# Altium schematic sheet AdamDynamic VCA-001.SchDoc
size A4; Organization: Altium Limited; Address1: 3 Minna Close; Address2: Belrose; Address3: NSW 2085; Address4: Australia
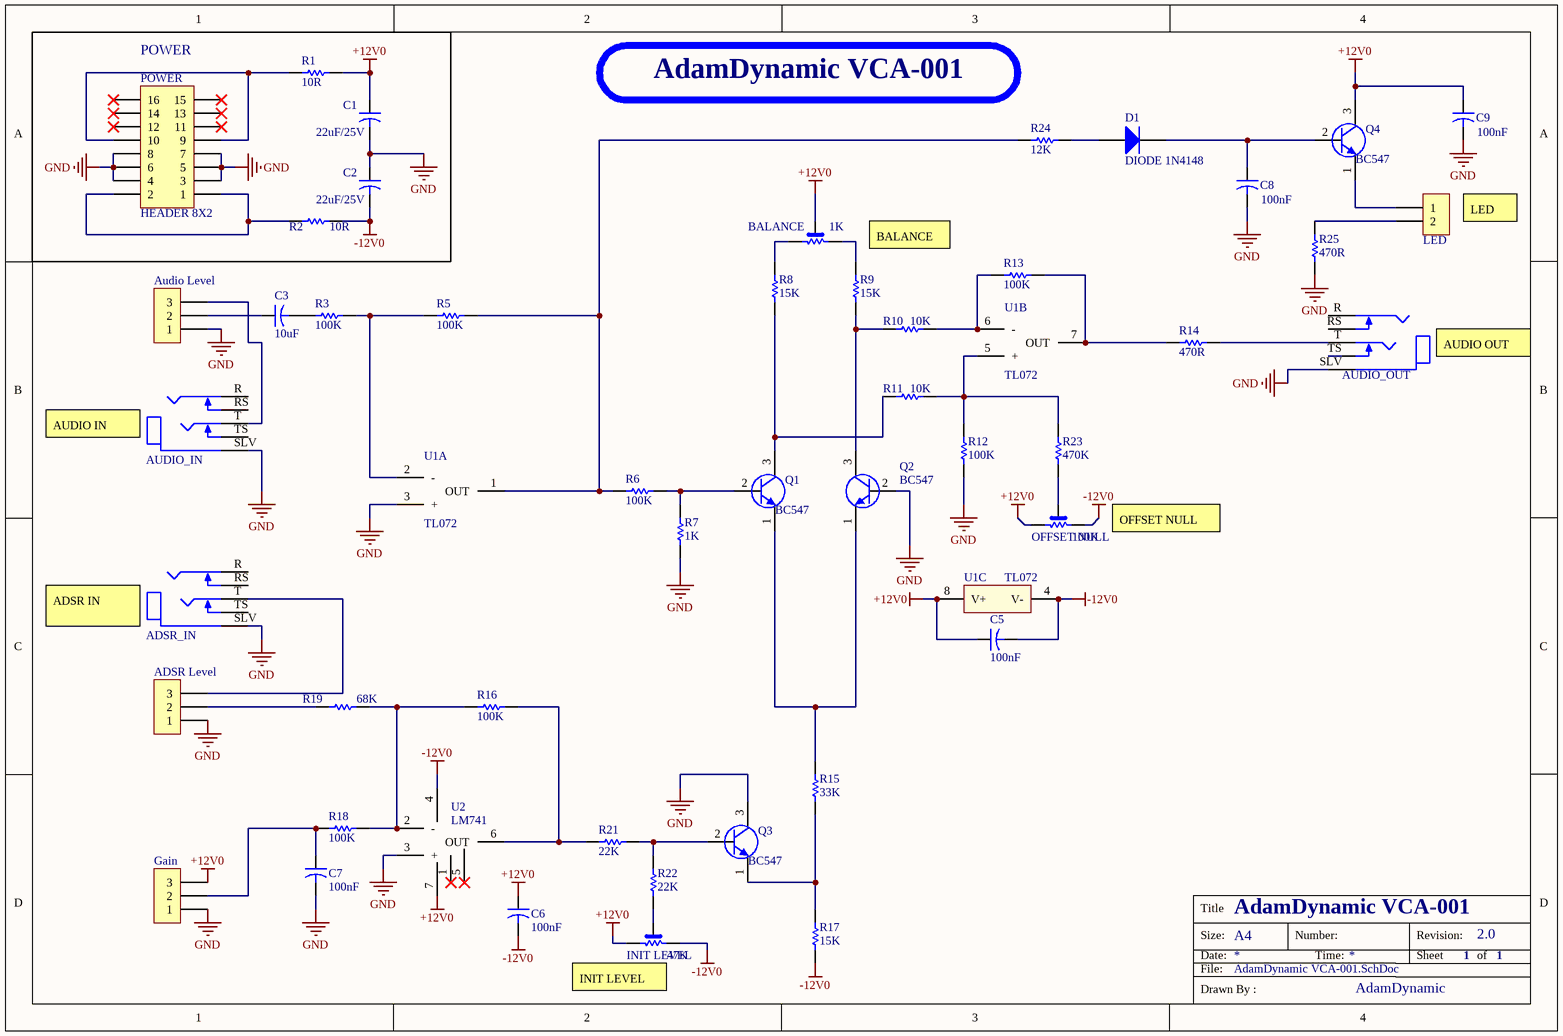
[diagram p0: AdamDynamic VCA-001.SchDoc]

## Parts
ADSR_IN  N114BPCX  [SWITCHCRAFT_N114BPCX]  (value not drawn)
ADSR_Level  SCREW TERMINAL 3WAY  [SCREW TERMINAL 3WAY]  (value not drawn)
AUDIO_IN  N114BPCX  [SWITCHCRAFT_N114BPCX]  (value not drawn)
Audio_Level  SCREW TERMINAL 3WAY  [SCREW TERMINAL 3WAY]  (value not drawn)
AUDIO_OUT  N114BPCX  [SWITCHCRAFT_N114BPCX]  (value not drawn)
BALANCE  1K  [RES VAR SQ]
C1  22uF/25V  [CAP 5X11]
C2  22uF/25V  [CAP 5X11]
C3  10uF  [CAP 5X11]
C5  100nF  [CAP RAD-0.3]
C6  100nF  [CAP RAD-0.3]
C7  100nF  [CAP RAD-0.3]
C8  100nF  [CAP RAD-0.3]
C9  100nF  [CAP RAD-0.3]
D1  DIODE 1N4148  [DO-35]
Gain  SCREW TERMINAL 3WAY  [SCREW TERMINAL 3WAY]  (value not drawn)
INIT_LEVEL  47K  [RES VAR SQ]
LED  SCREW TERMINAL 2WAY  [SCREW TERMINAL 2WAY]  (value not drawn)
OFFSET_NULL  100K  [RES VAR]
POWER  HEADER 8X2  [HEADER 8X2]
Q1  BC547  [TO92]
Q2  BC547  [TO92]
Q3  BC547  [TO92]
Q4  BC547  [TO92]
R1  10R  [RES 6.2 x 0.5 x 2.3]
R2  10R  [RES 6.2 x 0.5 x 2.3]
R3  100K  [RES 6.2 x 0.5 x 2.3]
R5  100K  [RES 6.2 x 0.5 x 2.3]
R6  100K  [RES 6.2 x 0.5 x 2.3]
R7  1K  [RES 6.2 x 0.5 x 2.3]
R8  15K  [RES 6.2 x 0.5 x 2.3]
R9  15K  [RES 6.2 x 0.5 x 2.3]
R10  10K  [RES 6.2 x 0.5 x 2.3]
R11  10K  [RES 6.2 x 0.5 x 2.3]
R12  100K  [RES 6.2 x 0.5 x 2.3]
R13  100K  [RES 6.2 x 0.5 x 2.3]
R14  470R  [RES 6.2 x 0.5 x 2.3]
R15  33K  [RES 6.2 x 0.5 x 2.3]
R16  100K  [RES 6.2 x 0.5 x 2.3]
R17  15K  [RES 6.2 x 0.5 x 2.3]
R18  100K  [RES 6.2 x 0.5 x 2.3]
R19  68K  [RES 6.2 x 0.5 x 2.3]
R21  22K  [RES 6.2 x 0.5 x 2.3]
R22  22K  [RES 6.2 x 0.5 x 2.3]
R23  470K  [RES 6.2 x 0.5 x 2.3]
R24  12K  [RES 6.2 x 0.5 x 2.3]
R25  470R  [RES 6.2 x 0.5 x 2.3]
U1  TL072  [DIP 8 PIN]  (parts A,B,C of 3)
U2  LM741  [DIP 8 PIN]

## Blocks framed on the sheet
POWER: C1 C2 POWER R1 R2

## Nets
+12V0: BALANCE.2 C1.1 C5.1 C6.1 C9.1 Gain.3 INIT_LEVEL.1 OFFSET_NULL.1 Q4.3(E) R1.1 U1.8(V+) U2.7
-12V0: C2.2 C5.2 C6.2 INIT_LEVEL.3 OFFSET_NULL.3 R2.1 R17.1 U1.4(V-) U2.4
GND: ADSR_IN.SLV(SLEEVE) ADSR_Level.1 AUDIO_IN.SLV(SLEEVE) Audio_Level.1 AUDIO_OUT.SLV(SLEEVE) C1.2 C2.1 C7.2 C8.2 C9.2 Gain.1 POWER.3 POWER.4 POWER.5 POWER.6 POWER.7 POWER.8 Q2.2(B) Q3.3(E) R7.2 R12.2 R25.2 U1.3(+) U2.3(+)
NetADSR_IN_T: ADSR_IN.T(TIP) ADSR_Level.3
NetADSR_Level_2: ADSR_Level.2 R19.2
NetAUDIO_IN_T: AUDIO_IN.T(TIP) Audio_Level.3
NetAudio_Level_2: Audio_Level.2 C3.1
NetAUDIO_OUT_T: AUDIO_OUT.T(TIP) R14.1
NetBALANCE_1: BALANCE.1 R8.2
NetBALANCE_3: BALANCE.3 R9.2
NetC3_2: C3.2 R3.2
NetC7_1: C7.1 Gain.2 R18.2
NetC8_1: C8.1 D1.2(K) Q4.2(B)
NetD1_1: D1.1(A) R24.1
NetINIT_LEVEL_2: INIT_LEVEL.2 R22.2
NetLED_1: LED.1 Q4.1(C)
NetLED_2: LED.2 R25.1
NetOFFSET_NULL_2: OFFSET_NULL.2 R23.2
NetPOWER_1: POWER.1 POWER.2 R2.2
NetPOWER_9: POWER.9 POWER.10 R1.2
NetQ1_1: Q1.1(C) Q2.1(C) R15.2
NetQ1_2: Q1.2(B) R6.1 R7.1
NetQ1_3: Q1.3(E) R8.1 R11.2
NetQ2_3: Q2.3(E) R9.1 R10.2
NetQ3_1: Q3.1(C) R15.1 R17.2
NetQ3_2: Q3.2(B) R21.1 R22.1
NetR3_1: R3.1 R5.2 U1.2(-)
NetR5_1: R5.1 R6.2 R24.2 U1.1(OUT)
NetR10_1: R10.1 R13.2 U1.6(-)
NetR11_1: R11.1 R12.1 R23.1 U1.5(+)
NetR13_1: R13.1 R14.2 U1.7(OUT)
NetR16_1: R16.1 R21.2 U2.6(OUT)
NetR16_2: R16.2 R18.1 R19.1 U2.2(-)

Not connected (* = marked no-connect by the designer): ADSR_IN R(RING) RS(RING_SHUNT) TS(TIP_SHUNT); AUDIO_IN R(RING) RS(RING_SHUNT) TS(TIP_SHUNT); AUDIO_OUT R(RING) RS(RING_SHUNT) TS(TIP_SHUNT); POWER 11* 12* 13* 14* 15* 16*; U2 1* 5*

## Notes on the sheet
- AdamDynamic VCA-001
- BALANCE
- (near LED) LED
- AUDIO OUT
- AUDIO IN
- (near OFFSET_NULL) OFFSET NULL
- ADSR IN
- (near INIT_LEVEL) INIT LEVEL
- 1         1
- 2.0
- AdamDynamic
- Title
- Size:
- Date:
- File:
- A4
- Number:
- Time:
- Revision:
- Sheet
- of
- Drawn By :

## Library data of the parts
ADSR_IN AUDIO_IN AUDIO_OUT = N114BPCX: Conn 1/4'' Phone Jack F 3 POS Solder ST Thru-Hole 5 Terminal 1 Port; Package: None; Price: None; Value: *; MP: N114BPCX; Availability: Unavailable
ADSR_Level Audio_Level Gain = SCREW TERMINAL 3WAY: SCREW TERMINAL 3WAY 5.08mm
BALANCE INIT_LEVEL OFFSET_NULL = ResTrimpot: Multiturn
  BALANCE: Value: 1K
  INIT_LEVEL: Value: 47K
  OFFSET_NULL: Value: 100K
C1-C3 C5-C9 = Capacitor Polar
  C1 C2: VALUE: 22uF/25V
  C3: VALUE: 10uF
  C5-C9: VALUE: 100nF
D1 = DIODE 1N4148: Small Signal Fast Switching Diodes
LED = SCREW TERMINAL 2WAY: SCREW TERMINAL 2WAY 5.08mm
Q1-Q4 = BC547: NPN Epitaxial Silicon Transistor
R1-R3 R5-R19 R21-R25 = Res2: Resistor; Published: 8-Jun-2000; LatestRevisionDate: 17-Jul-2002; LatestRevisionNote: Re-released for DXP Platform.; PackageReference: AXIAL-0.4; Publisher: Altium Limited
  R1 R2: Value: 10R
  R3 R5 R6 R12 R13 R16 R18: Value: 100K
  R7: Value: 1K
  R8 R9 R17: Value: 15K
  R10 R11: Value: 10K
  R14 R25: Value: 470R
  R15: Value: 33K
  R19: Value: 68K
  R21 R22: Value: 22K
  R23: Value: 470K
  R24: Value: 12K
U1 = TL072: Low-Noise FET-Input Operational Amplifiers